# Altium project PCB_Project.PrjPcb
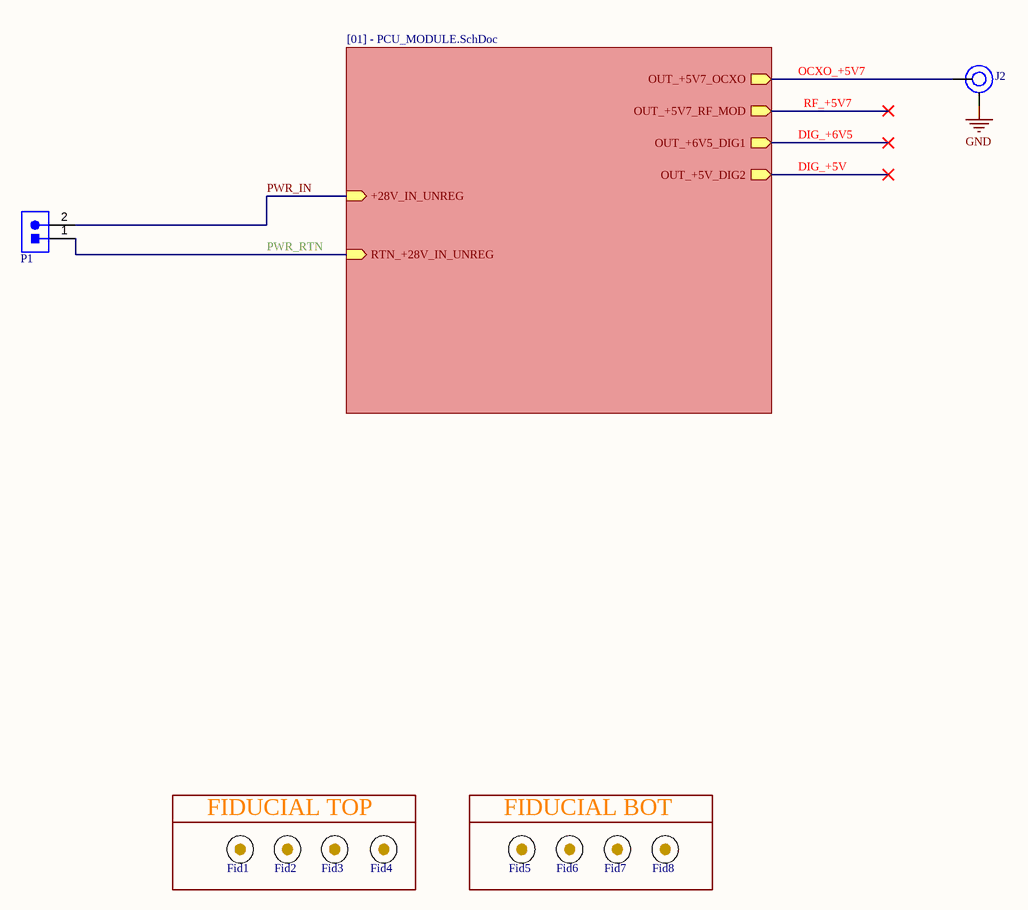
[diagram p0: [00] - INTERFACES_BOARD.SchDoc]
Author: Simone Roticiani; Date: 24/03/2025; MOD. COD.: 000-000-SP-000 rev1; PRJ_Description: DC_0000-B; PRJ_Part_Number: DC_0000; PRJ_SCH_name: DC_0000-SP-rev1
5 sheets, 59 parts. Net scope: hierarchical (ports join the sheet entries above them; power ports are global).
Board files: PCB_Project_1.PcbDoc, PCB_Project_2.PcbDoc
Sheets:
  [00] - INTERFACES_BOARD.SchDoc
     = [01] - PCU_MODULE.SchDoc
      SE05 = [02] - DCDC_+5V7.SchDoc
      SE12 = [04] - PSU_+5V_AUX.SchDoc
      SE10 = [03] - OUT_+5V7_OCXO_PROTECTION.SchDoc

## Sheet [00] - INTERFACES_BOARD.SchDoc
size 420 x 297 mm; CompanyName: Wave; SheetNumber: 1; SheetTotal: 5; PRJ_SheetSize: A3

### Parts
Fid1  Fiducial_V2  [Fiducial]  (value not drawn)  (no BOM)
Fid2  Fiducial_V2  [Fiducial]  (value not drawn)  (no BOM)
Fid3  Fiducial_V2  [Fiducial]  (value not drawn)  (no BOM)
Fid4  Fiducial_V2  [Fiducial]  (value not drawn)  (no BOM)
Fid5  Fiducial_V2  [Fiducial]  (value not drawn)  (no BOM)
Fid6  Fiducial_V2  [Fiducial]  (value not drawn)  (no BOM)
Fid7  Fiducial_V2  [Fiducial]  (value not drawn)  (no BOM)
Fid8  Fiducial_V2  [Fiducial]  (value not drawn)  (no BOM)
J2  SMPM-PC-P-EG-ST-SM-1  [SAMTEC_SMPM-PC-P-EG-ST-SM-1]  (value not drawn)
P1  61300211121  [61300211121]  (value not drawn)

### Blocks framed on the sheet
FIDUCIAL TOP: Fid1-Fid4
FIDUCIAL BOT: Fid5-Fid8

### Sub-sheets
? = [01] - PCU_MODULE.SchDoc: RTN_+28V_IN_UNREG (in), OUT_+5V7_OCXO (out), OUT_+5V7_RF_MOD (out), OUT_+6V5_DIG1 (out), OUT_+5V_DIG2 (out), +28V_IN_UNREG (in)

### Nets
GND: J2.2
DIG_+5V: sheet /OUT_+5V_DIG2
DIG_+6V5: sheet /OUT_+6V5_DIG1
OCXO_+5V7: J2.1 ; sheet /OUT_+5V7_OCXO
PWR_IN: P1.2 ; sheet /+28V_IN_UNREG  [project net OUT_DCDC_+12V]
PWR_RTN: P1.1 ; sheet /RTN_+28V_IN_UNREG
RF_+5V7: sheet /OUT_+5V7_RF_MOD

### Notes on the sheet
- Part Number:
- Description:
- Document:
- Date:
- Size:
- Sheet Title:
- Sheet
- of
- Author:
- MOD. COD.:

### Library data of the parts
Fid1-Fid8 = Fiducial_V2: Fiducial No Pin; Category: Miscellaneous
J2 = SMPM-PC-P-EG-ST-SM-1: Connector SMPM Plug Catchers Mitt 0Hz to 65GHz 50Ohm Solder Straight Surface Mount Gold; Manufacturer: Samtec; Supplier 1: mouser; Manufacturer Part Number: SMPM-PC-P-EG-ST-SM-1; RoHS: No; Category: Connectors; Stock 1: 329; Pricing 1: 1=15,71, 10=14,83, 25=14,31, 50=13,96, 100=12,66, 250=12,22, 500=11,7625 (USD); ComponentLink1URL: https://datasheet.octopart.com/SMPM-PF-P-EG-ST-SM-1-Samtec-datasheet-158267789.pdf?src-supplier=Sager+Electronics; ComponentLink1Description: https://datasheet.octopart.com/SMPM-PF-P-EG-ST-SM-1-Samtec-datasheet-158267789.pdf?src-supplier=Sager+Electronics; Supplier Part Number 1: 200-SMPM-PC-PEGSTSM1
P1 = 61300211121: THT Vertical Pin Header WR-PHD, Pitch 2.54 mm, Single Row, 2 pins; Manufacturer: Wurth Electronics; Current Rating: 3A; Voltage Rating: 250V; Number of Positions: 2; Gender: Male; Connector Type: Male Pin; Pitch: 0.1inch; Supplier 1: RSComponents; Manufacturer Part Number: 61300211121; RoHS: Yes; Category: Headers and Wire Housings; Stock 1: 1855; Pricing 1: 5=0,14100, 50=0,09700, 100=0,07800, 200=0,07300, 500=0,06800 (USD); Mount: Through Hole; Contact Plating: Gold; Housing Material: PBT; Contact Material: Copper Alloy,Copper; Color: Black; Min Operating Temperature: -40°C; Max Operating Temperature: 125°C; Number of Rows: 1; Contact Gender: Male; Packaging: Bulk; Termination: Through Hole; Number of Contacts: 2; Contact Mating Length: 0.236inch; REACH SVHC: Unknown; Lead Free: Lead Free; ComponentLink1URL: https://datasheet.ciiva.com/13619/6130xx11121-48870-13619345.pdf?src-supplier=Mouser; ComponentLink1Description: https://datasheet.ciiva.com/13619/6130xx11121-48870-13619345.pdf?src-supplier=Mouser; Supplier Part Number 1: 8281581

## Sheet [01] - PCU_MODULE.SchDoc
size 297 x 209 mm; CompanyName: Wave; SheetNumber: 2; SheetTotal: 5; PRJ_SheetSize: A4
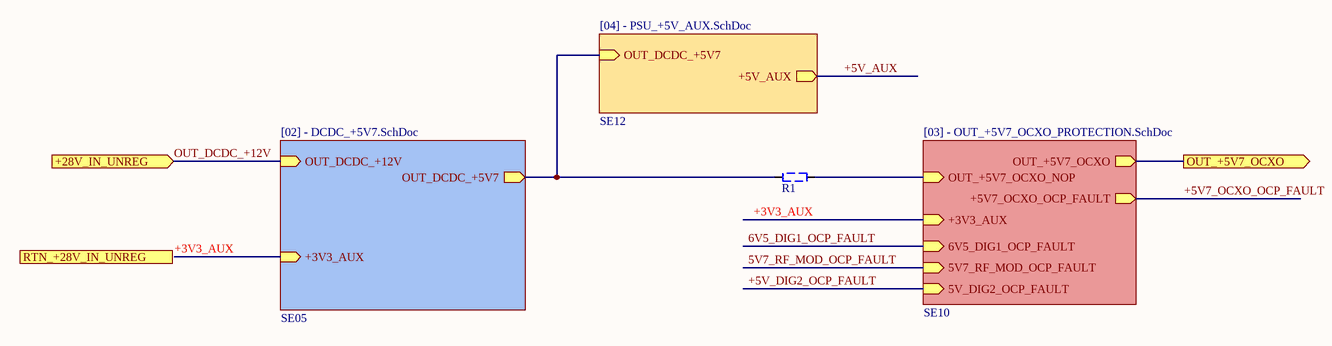
[diagram p1: [01] - PCU_MODULE.SchDoc]

### Parts
R1  NoBom  [RESC1608X50N]  (value not drawn)  (no BOM)

### Sub-sheets
SE05 = [02] - DCDC_+5V7.SchDoc: OUT_DCDC_+12V (in), +3V3_AUX (in), OUT_DCDC_+5V7 (out)
SE10 = [03] - OUT_+5V7_OCXO_PROTECTION.SchDoc: OUT_+5V7_OCXO_NOP (in), +3V3_AUX (in), OUT_+5V7_OCXO (out), +5V7_OCXO_OCP_FAULT (out), 6V5_DIG1_OCP_FAULT (in), 5V7_RF_MOD_OCP_FAULT (in), 5V_DIG2_OCP_FAULT (in)
SE12 = [04] - PSU_+5V_AUX.SchDoc: OUT_DCDC_+5V7 (in), +5V_AUX (out)

### Ports
+28V_IN_UNREG (in, see [00] - INTERFACES_BOARD[4C]), OUT_+5V7_OCXO (out, see [00] - INTERFACES_BOARD[5B], [03] - OUT_+5V7_OCXO_PROTECTION[4A]), RTN_+28V_IN_UNREG (see [00] - INTERFACES_BOARD[4C])

### Nets
+3V3_AUX: sheet SE05/+3V3_AUX, sheet SE10/+3V3_AUX
OCXO_+5V7: port OUT_+5V7_OCXO, sheet SE10/OUT_+5V7_OCXO
OUT_DCDC_+12V: port +28V_IN_UNREG, sheet SE05/OUT_DCDC_+12V
NetC3_2: R1.1 ; sheet SE05/OUT_DCDC_+5V7, sheet SE12/OUT_DCDC_+5V7
NetQ1_5: R1.2 ; sheet SE10/OUT_+5V7_OCXO_NOP

### Notes on the sheet
- Part Number:
- Description:
- Document:
- Date:
- Size:
- Sheet Title:
- Sheet
- of
- Author:
- MOD. COD.:

### Library data of the parts
R1 = 1RES_NO_BOM: Resistore Non in BOM; Category: Resistors

## Sheet [02] - DCDC_+5V7.SchDoc
size 297 x 209 mm; CompanyName: Wave; SheetNumber: 4; SheetTotal: 5; PRJ_SheetSize: A4
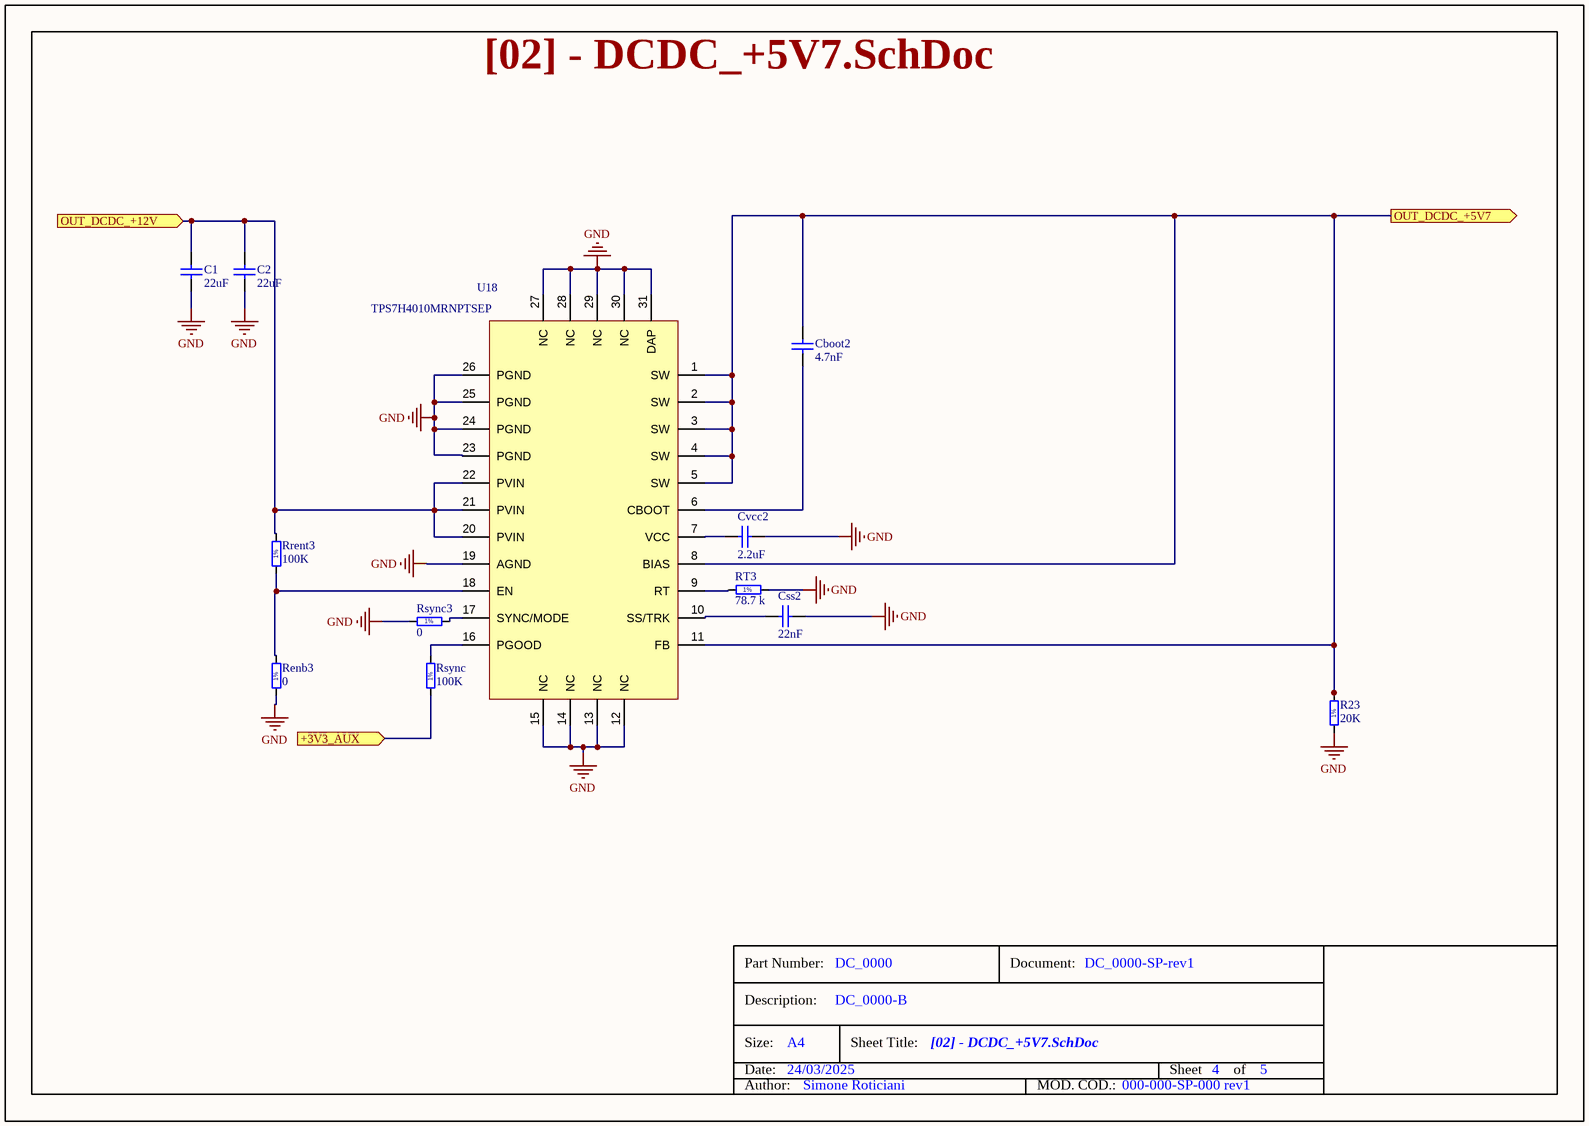
[diagram p2: [02] - DCDC_+5V7.SchDoc]

### Parts
C1  22uF  [CAPC320X160X180L55N]
C2  22uF  [CAPC320X160X180L55N]
Cboot2  4.7nF  [CAPC100X55X55L35N]
Css2  22nF  [CAPC100X55X55L35N]
Cvcc2  2.2uF  [CAPC100X55X55L35N]
R23  20K  [RESC100X50X40L25N]
Renb3  0  [RESC100X50X40L25N]
Rrent3  100K  [RESC100X50X40L25N]
Rsync  100K  [RESC100X50X40L25N]
Rsync3  0  [RESC100X50X40L25N]
RT3  78.7 k  [RESC100X50X40L25N]
U18  TPS7H4010MRNPTSEP  [TPS7H4010MRNPTSEP]

### Ports
+3V3_AUX (in, see [01] - PCU_MODULE[2B], [03] - OUT_+5V7_OCXO_PROTECTION[1C]), OUT_DCDC_+5V7 (out, see [01] - PCU_MODULE[2A], [04] - PSU_+5V_AUX[1A]), OUT_DCDC_+12V (in, see [01] - PCU_MODULE[2A])

### Nets
GND: C1.1 C2.1 Css2.2 Cvcc2.2 R23.1 Renb3.1 Rsync3.1 RT3.2 U18.12(NC) U18.13(NC) U18.14(NC) U18.15(NC) U18.19(AGND) U18.23(PGND) U18.24(PGND) U18.25(PGND) U18.26(PGND) U18.27(NC) U18.28(NC) U18.29(NC) U18.30(NC) U18.31(DAP)
+3V3_AUX: Rsync.1 ; port +3V3_AUX
OUT_DCDC_+12V: C1.2 C2.2 Rrent3.2 U18.20(PVIN) U18.21(PVIN) U18.22(PVIN) ; port OUT_DCDC_+12V
NetC3_2: Cboot2.2 R23.2 U18.1(SW) U18.2(SW) U18.3(SW) U18.4(SW) U18.5(SW) U18.8(BIAS) U18.11(FB) ; port OUT_DCDC_+5V7
NetCboot2_1: Cboot2.1 U18.6(CBOOT)
NetCss2_1: Css2.1 U18.10(SS/TRK)
NetCvcc2_1: Cvcc2.1 U18.7(VCC)
NetRenb3_2: Renb3.2 Rrent3.1 U18.18(EN)
NetRsync3_2: Rsync3.2 U18.17(SYNC/MODE)
NetRsync_2: Rsync.2 U18.16(PGOOD)
NetRT3_1: RT3.1 U18.9(RT)

### Notes on the sheet
- Part Number:
- Description:
- Document:
- Date:
- Size:
- Sheet Title:
- Sheet
- of
- Author:
- MOD. COD.:
- (in symbol CRCW040220K0FKED) 1%
- (in symbol CRCW040278K7FKED) 1%
- (in symbol CRCW0402100KFKED) 1%

### Library data of the parts
C1 C2 = GRM31CC71E226ME15L: CAP CER 22uF 25V ±20% X7S 1206; Manufacturer: Murata; Material: 4241ConductorMaterial; Dielectric: 1542DielectricType; ComponentLink1URL: https://search.murata.co.jp/Ceramy/image/img/A01X/G101/ENG/GRM31CC71E226ME15-01A.pdf; ComponentLink1Description: Datasheet; Supplier: Digikey; Manufacturer Part Number: GRM31CC71E226ME15L; RoHS: No; Category: Ceramic Capacitors; Stock 1: 3447; Pricing 1: 1=0,92, 10=0,562, 50=0,4202, 100=0,3759, 500=0,30056, 1000=0,27702 (USD); Case/Package: 340Case; Min Operating Temperature: -55°C; Max Operating Temperature: 125°C; Capacitance: 22uF; Tolerance: 20%; Voltage Rating: 25V; Voltage Rating (DC): 25V; Length: 3.2mm; Width: 1.6mm; Height: 1.9mm; Thickness: 1.6mm; Supplier Part Number: 490-GRM31CC71E226ME15LCT-ND
Cboot2 = GRM155R71E472KA01: 0402 4.7 nF 25 V ±10% Tolerance X7R SMT Multilayer Ceramic Capacitor; Manufacturer: Murata; Manufacturer Part Number: GRM155R71E472KA01D; Supplier: Farnell; Supplier Part Number: 4326802; RoHS: Yes; Category: Ceramic Capacitors; Stock: 39799; Pricing: 10=0,015, 100=0,01, 500=0,007, 2500=0,006, 5000=0,0059 (EUR); Pins: 2NUMBER; Material: 4241ConductorMaterial; Lead Free: 5697LeadFree; ComponentLink1URL: https://datasheet.ciiva.com/18184/getdatasheetpartid-129543-18184709.pdf?src-supplier=Verical; ComponentLink1Description: https://datasheet.ciiva.com/18184/getdatasheetpartid-129543-18184709.pdf?src-supplier=Verical; ComponentLink2URL: https://datasheet.ciiva.com/130/product-130032.pdf?src-supplier=Digikey; ComponentLink2Description: https://datasheet.ciiva.com/130/product-130032.pdf?src-supplier=Digikey; ComponentLink3URL: https://datasheet.ciiva.com/16392/product-16392847.pdf?src-supplier=Future+Electronics; ComponentLink3Description: https://datasheet.ciiva.com/16392/product-16392847.pdf?src-supplier=Future+Electronics; ComponentLink4URL: https://datasheet.ciiva.com/2989/product-2989394.pdf?src-supplier=Avnet; ComponentLink4Description: https://datasheet.ciiva.com/2989/product-2989394.pdf?src-supplier=Avnet; ComponentLink5URL: https://datasheet.ciiva.com/2989/product-2989393.pdf?src-supplier=Avnet; ComponentLink5Description: https://datasheet.ciiva.com/2989/product-2989393.pdf?src-supplier=Avnet; ComponentLink6URL: https://datasheet.ciiva.com/130/partnumbering-e-01-130033.pdf?src-supplier=Digikey; ComponentLink6Description: https://datasheet.ciiva.com/130/partnumbering-e-01-130033.pdf?src-supplier=Digikey; ComponentLink7URL: https://datasheet.ciiva.com/130/partnumbering-e-01-130034.pdf?src-supplier=Digikey; ComponentLink7Description: https://datasheet.ciiva.com/130/partnumbering-e-01-130034.pdf?src-supplier=Digikey
Css2 = GRM155R71E223JA61: Multilayer Ceramic Capacitor, 0.022 uF, 25 V, ± 5%, X7R, 0402 [1005 Metric]; Manufacturer: Murata; Manufacturer Part Number: GRM155R71E223JA61D; Supplier: Farnell; Supplier Part Number: 3582812; RoHS: Yes; Category: Ceramic Capacitors; Stock: 11149; Pricing: 10=0,017, 100=0,013, 500=0,012, 2500=0,0118, 5000=0,0115 (EUR); Material: 4241ConductorMaterial; ComponentLink1URL: https://datasheet.ciiva.com/5427/product-5427580.pdf?src-supplier=Mouser; ComponentLink1Description: https://datasheet.ciiva.com/5427/product-5427580.pdf?src-supplier=Mouser; ComponentLink2URL: https://datasheet.ciiva.com/29535/grm155r71e223ka61-01-29535418.pdf?src-supplier=Digikey; ComponentLink2Description: https://datasheet.ciiva.com/29535/grm155r71e223ka61-01-29535418.pdf?src-supplier=Digikey
Cvcc2 = GRM155D71C225ME11: Multilayer Ceramic Capacitor, 2.2 uF, 16 V, ± 20%, X7T, 0402 [1005 Metric]; Manufacturer: Murata; Manufacturer Part Number: GRM155D71C225ME11D; Dielectric: 1545DielectricType; Voltage Rating: 16V; Supplier: Mouser; Supplier Part Number: 81-GRM155D71C225ME11; RoHS: Yes; Category: Ceramic Capacitors; Stock: 102807; Pricing: 1=0,17, 10=0,113, 50=0,113, 100=0,073, 1000=0,067, 10000=0,057 (USD); Case/Package: 343Case; Material: 4241ConductorMaterial; Min Operating Temperature: -55°C; Max Operating Temperature: 125°C; Value: 2.2uF; Tolerance: 20%; Voltage Rating (DC): 16V; Length: 1mm; Width: 500um; Height: 650um; Thickness: 500um; RoHS Compliant: Yes; ComponentLink1URL: https://datasheet.octopart.com/GRM155D71C225ME11D-Murata-datasheet-165579666.pdf?src-supplier=TME; ComponentLink1Description: https://datasheet.octopart.com/GRM155D71C225ME11D-Murata-datasheet-165579666.pdf?src-supplier=TME
R23 = CRCW040220K0FKED: RES 20K OHM 1/16W 1% 0402; Manufacturer: Vishay Dale; Power (Watts): 0,063 W, 1/16 W; Temperature Coefficient: ±100 ppm/ °C; Category: Resistors; Resistance: 20K; Tolerance: ±1%; Footprint Name: RESC1005X40N; ComponentLink1URL: http://www.vishay.com/docs/20035/dcrcwe3.pdf; ComponentLink1Description: Datasheet; Packaging: Cut Tape (CT); Supplier Part Number 1: 541-20.0KLCT-ND; Supplier 1: Digi-Key; Features: AEC Q100 automotive; Operating Temperature: -55 °C ~ 155 °C; Package / Case: 0402 (1005 metrico); Manufacturer Part Number: CRCW040220K0FKED; Part Status: Active; Composition: Thick Film; Manufacturer 1: Vishay Dale; Manufacturer Part Number 1: CRCW040220K0FKED
Renb3 Rsync Rsync3 = CRCW0402100KFKED: RES  100K OHM 1/16W 1% 0402; Manufacturer: Vishay Dale; Power (Watts): 0,063 W, 1/16 W; Temperature Coefficient: ±100 ppm/ °C; Category: Resistors; Resistance: 100K; Tolerance: ±1%; Footprint Name: RESC1005X40N; ComponentLink1URL: http://www.vishay.com/docs/20035/dcrcwe3.pdf; ComponentLink1Description: Datasheet; Packaging: Cut Tape (CT); Supplier Part Number 1: 541-100KLCT-ND; Supplier 1: Digi-Key; Features: AEC Q100 automotive; Operating Temperature: -55 °C ~ 155 °C; Package / Case: 0402 (1005 metrico); Manufacturer Part Number: CRCW0402100KFKED; Part Status: Active; Composition: Thick Film; Manufacturer 1: Vishay Dale; Manufacturer Part Number 1: CRCW0402100KFKED
Rrent3 = CRCW0402100KFKED: RES 100K OHM 1/16W 1% 0402; Manufacturer: Vishay Dale; Power (Watts): 0,063 W, 1/16 W; Temperature Coefficient: ±100 ppm/ °C; Category: Resistors; Resistance: 100K; Tolerance: ±1%; Footprint Name: RESC1005X40N; ComponentLink1URL: http://www.vishay.com/docs/20035/dcrcwe3.pdf; ComponentLink1Description: Datasheet; Packaging: Cut Tape (CT); Supplier Part Number 1: 541-100KLCT-ND; Supplier 1: Digi-Key; Features: AEC Q100 automotive; Operating Temperature: -55 °C ~ 155 °C; Package / Case: 0402 (1005 metrico); Manufacturer Part Number: CRCW0402100KFKED; Part Status: Active; Composition: Thick Film; Manufacturer 1: Vishay Dale; Manufacturer Part Number 1: CRCW0402100KFKED
RT3 = CRCW040278K7FKED: RES 78K7 OHM 1/16W 1% 0402; Manufacturer: Vishay Dale; Power (Watts): 0,063 W, 1/16 W; Temperature Coefficient: ±100 ppm/ °C; Category: Resistors; Resistance: 78K7; Tolerance: ±1%; Footprint Name: RESC1005X40N; ComponentLink1URL: http://www.vishay.com/docs/20035/dcrcwe3.pdf; ComponentLink1Description: Datasheet; Packaging: Cut Tape (CT); Supplier Part Number 1: 541-78.7KLCT-ND; Supplier 1: DigiKey; Features: AEC Q100 automotive; Operating Temperature: -55 °C ~ 155 °C; Package / Case: 0402 (1005 metrico); Manufacturer Part Number: CRCW040278K7FKED; Part Status: Active; Composition: Thick Film; Manufacturer 1: Vishay Dale; Manufacturer Part Number 1: CRCW040278K7FKED
U18 = TPS7H4010MRNPTSEP: Buck Switching Regulator IC Positive Adjustable 1V 1 Output 6A 30-WFQFN Exposed Pad; Manufacturer: Texas Instruments; Supplier: Digikey; Manufacturer Part Number: TPS7H4010MRNPTSEP; RoHS: Yes; Category: Integrated Circuits (ICs); Supplier Part Number: 296-TPS7H4010MRNPTSEP-ND; ComponentLink1Description: Datasheet; ComponentLink1URL: https://www.ti.com/lit/ds/symlink/tps7h4010-sep.pdf?ts=1730267059055&ref_url=https%253A%252F%252Fwww.mouser.ca%252F

## Sheet [04] - PSU_+5V_AUX.SchDoc
size 297 x 209 mm; CompanyName: Wave; SheetNumber: 5; SheetTotal: 5; PRJ_SheetSize: A4
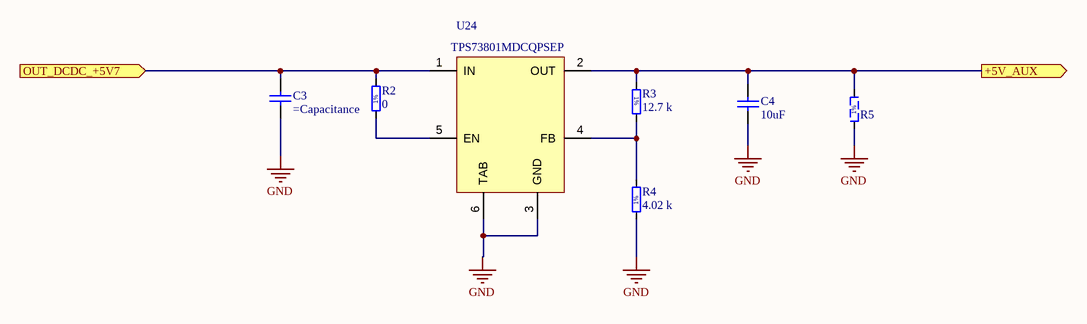
[diagram p3: [04] - PSU_+5V_AUX.SchDoc]

### Parts
C3  (no value)  [CAPC100X55X55L35N]
C4  10uF  [CAPC320X160X180L55N]
R2  0  [RESC100X50X40L25N]
R3  12.7 k  [RESC100X50X40L25N]
R4  4.02 k  [RESC100X50X40L25N]
R5  NoBom  [RESC2012X60N]  (value not drawn)  (no BOM)
U24  TPS73801MDCQPSEP  [SOT127P706X180-6N]

### Ports
+5V_AUX (out, see [01] - PCU_MODULE[3A]), OUT_DCDC_+5V7 (in, see [01] - PCU_MODULE[3A], [02] - DCDC_+5V7[4A])

### Nets
GND: C3.1 C4.1 R4.1 R5.1 U24.3(GND) U24.6(TAB)
+5V_AUX: C4.2 R3.1 R5.2 U24.2(OUT) ; port +5V_AUX
NetC3_2: C3.2 R2.2 U24.1(IN) ; port OUT_DCDC_+5V7
NetR2_1: R2.1 U24.5(EN)
NetR3_2: R3.2 R4.2 U24.4(FB)

### Notes on the sheet
- Part Number:
- Description:
- Document:
- Date:
- Size:
- Sheet Title:
- Sheet
- of
- Author:
- MOD. COD.:
- (in symbol 1RES_NO_BOM_0805) 1%
- (in symbol CRCW04024K02FKED) 1%
- (in symbol CRCW040212K7FKED) 1%
- (in symbol CRCW04020000Z0EDC) 1%

### Library data of the parts
C3 = GRM155R71E223JA61: Multilayer Ceramic Capacitor, 0.022 uF, 25 V, ± 5%, X7R, 0402 [1005 Metric]; Manufacturer: Murata; Manufacturer Part Number: GRM155R71E223JA61D; Material: 4241ConductorMaterial; Supplier: Farnell; Supplier Part Number: 3582812; RoHS: Yes; Category: Ceramic Capacitors; Stock: 11149; Pricing: 10=0,017, 100=0,013, 500=0,012, 2500=0,0118, 5000=0,0115 (EUR); ComponentLink1URL: https://datasheet.ciiva.com/5427/product-5427580.pdf?src-supplier=Mouser; ComponentLink1Description: https://datasheet.ciiva.com/5427/product-5427580.pdf?src-supplier=Mouser; ComponentLink2URL: https://datasheet.ciiva.com/29535/grm155r71e223ka61-01-29535418.pdf?src-supplier=Digikey; ComponentLink2Description: https://datasheet.ciiva.com/29535/grm155r71e223ka61-01-29535418.pdf?src-supplier=Digikey
C4 = C3216X7R1H106K160AC: CAP CER 10UF 50V X7R 1206; Manufacturer: TDK; Material: 4241ConductorMaterial; Tolerance: 10%; Dielectric: 1511DielectricType; Supplier 1: Avnet; Manufacturer Part Number: C3216X7R1H106K160AC; RoHS: Yes; Category: Ceramic Capacitors; Stock 1: 19909; Pricing 1: 1=0,797, 10=0,603, 25=0,57, 50=0,537, 100=0,505 (USD); Mount: Surface Mount; Case/Package: 1206; Case Code (Imperial): 1206; Case Code (Metric): 3216; Min Operating Temperature: -55°C; Max Operating Temperature: 125°C; Series: C; Packaging: Cut Tape; Capacitance: 10uF; Voltage Rating: 50V; Voltage Rating (DC): 50V; Length: 3.2mm; Width: 1.6mm; Height: 1.9mm; Thickness: 1.6mm; RoHS Compliant: Yes; Lead Free: 5697LeadFree; ComponentLink1URL: https://product.tdk.com/info/en/catalog/datasheets/mlcc_commercial_general_en.pdf?src-supplier=Digikey; ComponentLink1Description: https://product.tdk.com/info/en/catalog/datasheets/mlcc_commercial_general_en.pdf?src-supplier=Digikey; ComponentLink2URL: https://datasheet.octopart.com/C3216X7R1H106K160AC-TDK-datasheet-159617022.pdf?src-supplier=TME; ComponentLink2Description: https://datasheet.octopart.com/C3216X7R1H106K160AC-TDK-datasheet-159617022.pdf?src-supplier=TME; Supplier Part Number 1: 71AH3370
R2 = CRCW04020000Z0EDC: RES 0 OHM 1/16W 1% 0402; Manufacturer: Vishay; Temperature Coefficient: ±100 ppm/ °C; Power (Watts): 0,063 W, 1/16 W; Supplier 1: Digi-Key; Manufacturer Part Number: CRCW04020000Z0EDC; Resistance: 0; Tolerance: ±1%; ComponentLink1URL: http://www.vishay.com/docs/28773/crcwce3.pdf?src-supplier=Digi-Key; ComponentLink1Description: http://www.vishay.com/docs/28773/crcwce3.pdf?src-supplier=Digi-Key; Supplier Part Number 1: 541-4062-1-ND; Manufacturer 1: Vishay; Manufacturer Part Number 1: CRCW04020000Z0EDC; Category: Resistors; Composition: Thick Film; Features: AEC Q100 automotive; Footprint Name: RESC100X50X40L25N; Operating Temperature: -55 °C ~ 155 °C; Package / Case: 0402 (1005 metrico); Packaging: Cut Tape (CT); Part Status: Active; Description 1: RES 0 OHM 1/16W 1% 0402
R3 = CRCW040212K7FKED: RES 12K7 OHM 1/16W 1% 0402; Manufacturer: Vishay Dale; Power (Watts): 0,063 W, 1/16 W; Temperature Coefficient: ±100 ppm/ °C; Category: Resistors; Resistance: 12K7; Tolerance: ±1%; Footprint Name: RESC1005X40N; ComponentLink1URL: http://www.vishay.com/docs/20035/dcrcwe3.pdf; ComponentLink1Description: Datasheet; Packaging: Cut Tape (CT); Supplier Part Number 1: 541-12.7KLCT-ND; Supplier 1: Digi-Key; Features: AEC Q100 automotive; Operating Temperature: -55 °C ~ 155 °C; Package / Case: 0402 (1005 metrico); Manufacturer Part Number: CRCW040212K7FKED; Part Status: Active; Composition: Thick Film; Manufacturer 1: Vishay Dale; Manufacturer Part Number 1: CRCW040212K7FKED
R4 = CRCW04024K02FKED: RES 4K02 OHM 1/16W 1% 0402; Manufacturer: Vishay Dale; Power (Watts): 0,063 W, 1/16 W; Temperature Coefficient: ±100 ppm/ °C; Category: Resistors; Resistance: 4K02; Tolerance: ±1%; Footprint Name: RESC1005X40N; ComponentLink1URL: http://www.vishay.com/docs/20035/dcrcwe3.pdf; ComponentLink1Description: Datasheet; Packaging: Cut Tape (CT); Supplier Part Number 1: 541-4.02KLCT-ND; Supplier 1: DigiKey; Features: AEC Q100 automotive; Operating Temperature: -55 °C ~ 155 °C; Package / Case: 0402 (1005 metrico); Manufacturer Part Number: CRCW04024K02FKED; Part Status: Active; Composition: Thick Film; Manufacturer 1: Vishay Dale; Manufacturer Part Number 1: CRCW04024K02FKED
R5 = 1RES_NO_BOM_0805: Resistore Non in BOM; Category: Resistors
U24 = TPS73801MDCQPSEP: LDO Voltage Regulators Radiation-tolerant, 2.2-V to 20-V input, 1-A adjustable LDO regulator in a plastic package 6-SOT-223 -55 to 125; Manufacturer: Texas Instruments; Voltage - Output: 1.21V ~ -20 V; Current - Output: 1A; Voltage - Input: 1.4V ~ -20 V; Number of Regulators: 1; Regulator Type: Positive Adjustable; Supplier: Mouser; Supplier Part Number: 595-TPS73801MDCQPSEP; Manufacturer Part Number: TPS73801MDCQPSEP; RoHS: RoHS Compliant; Category: Regulators; Packaging: Cut Tape (CT); Part Status: Active; Operating Temperature: -55°C ~ 125°C; Mounting Type: Surface Mount; Package / Case: SOT-223 (6); ComponentLink1URL: https://www.ti.com/lit/ds/symlink/tps73801-sep.pdf?ts=1731944378746&ref_url=https%253A%252F%252Fwww.ti.com%252Fproduct%252FTPS73801-SEP; ComponentLink1Description: Datasheet

## Sheet [03] - OUT_+5V7_OCXO_PROTECTION.SchDoc
size 297 x 209 mm; CompanyName: Wave; SheetNumber: 3; SheetTotal: 5; PRJ_SheetSize: A4
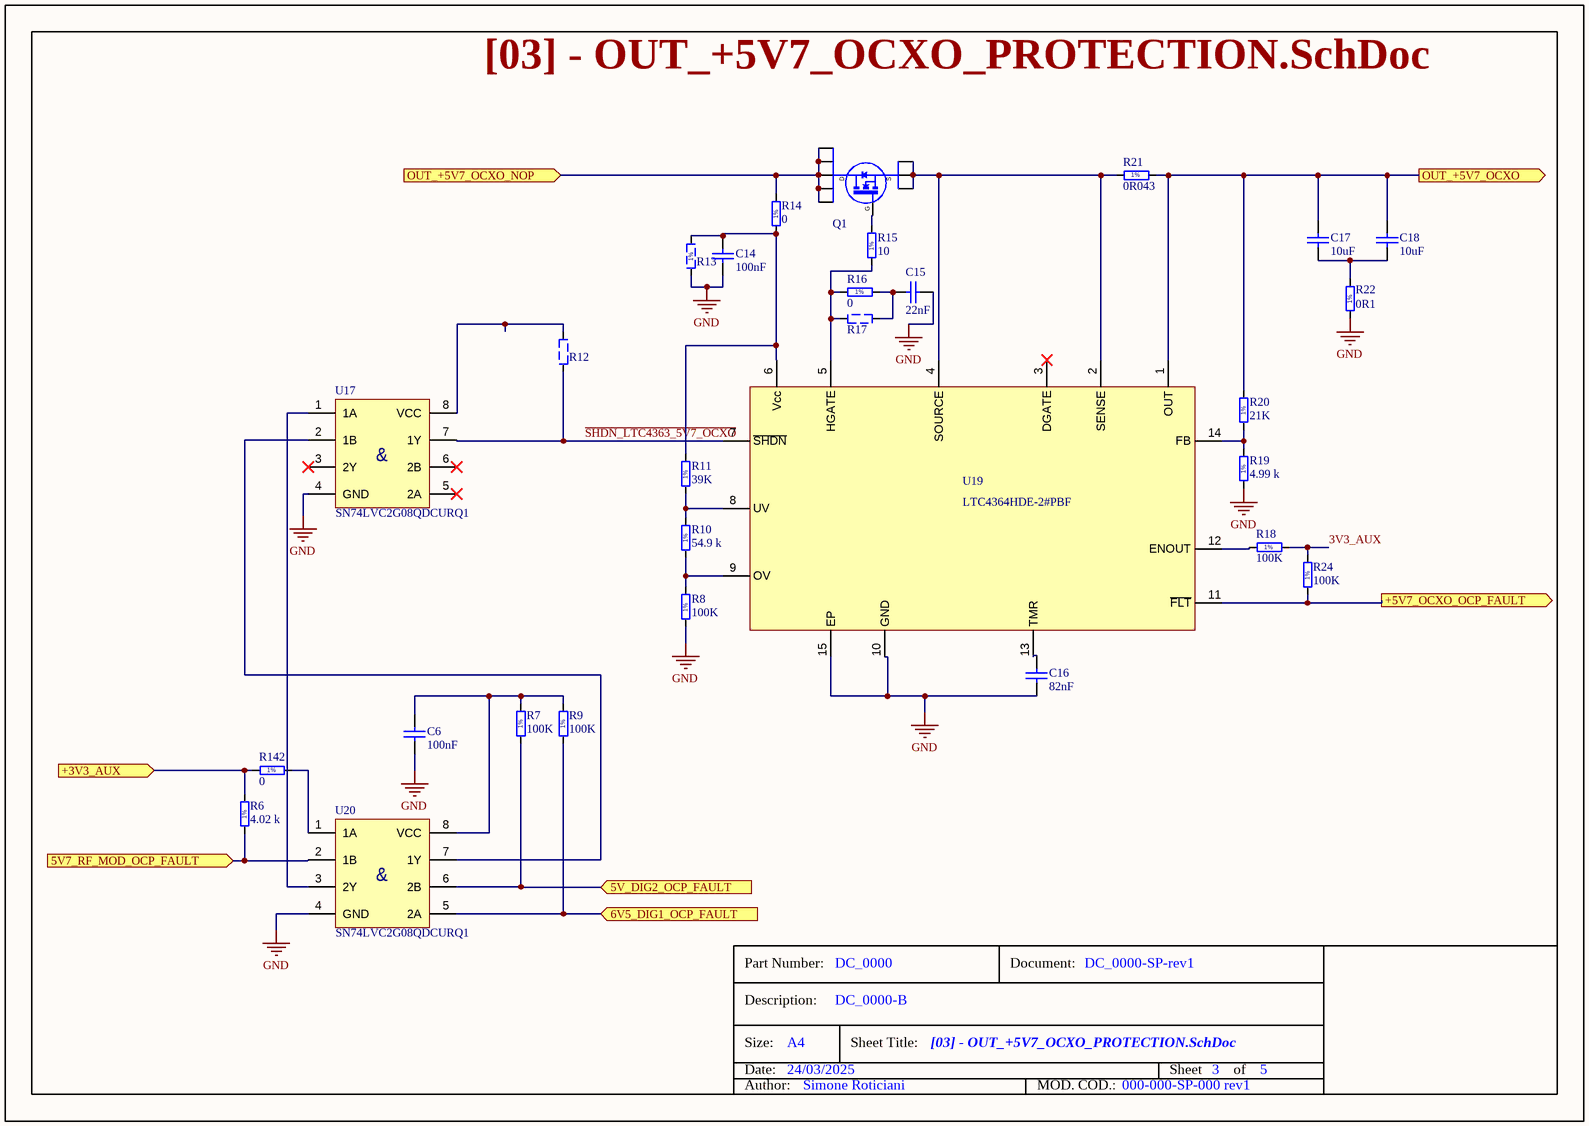
[diagram p4: [03] - OUT_+5V7_OCXO_PROTECTION.SchDoc]

### Parts
C6  100nF  [CAPC100X50X55L25N]
C14  100nF  [CAPC100X50X55L25N]
C15  22nF  [CAPC160X80X90L35N]
C16  82nF  [CAPC160X80X90L35N]
C17  10uF  [CAPC320X160X180L55N]
C18  10uF  [CAPC320X160X180L55N]
Q1  SI7414DN-T1-GE3  [Vishay PowerPAK 1212-8 package]  (value not drawn)
R6  4.02 k  [RESC100X50X40L25N]
R7  100K  [RESC100X50X40L25N]
R8  100K  [RESC100X50X40L25N]
R9  100K  [RESC100X50X40L25N]
R10  54.9 k  [RESC100X50X40L25N]
R11  39K  [RESC100X50X40L25N]
R12  NoBom  [RESC1608X50N]  (value not drawn)  (no BOM)
R13  NoBom  [RESC155X85X55L30N - NO BOM]  (value not drawn)  (no BOM)
R14  0  [RESC155X85X55L30N]
R15  10  [RESC100X50X40L25N]
R16  0  [RESC100X50X40L25N]
R17  NoBom  [RESC1608X50N]  (value not drawn)  (no BOM)
R18  100K  [RESC100X50X40L25N]
R19  4.99 k  [RESC100X50X40L25N]
R20  21K  [RESC100X50X40L25N]
R21  0R043  [RESC315X160X65L50N]
R22  0R1  [RESC100X50X40L25N]
R24  100K  [RESC100X50X40L25N]
R142  0  [RESC100X50X40L25N]
U17  SN74LVC2G08QDCURQ1  [SOP50P310X90-8N]
U19  LTC4364HDE-2#PBF  [DFN15P50_300X400X80L40X30T175X335]
U20  SN74LVC2G08QDCURQ1  [SOP50P310X90-8N]

### Ports
5V7_RF_MOD_OCP_FAULT (in, see [01] - PCU_MODULE[3B]), 5V_DIG2_OCP_FAULT (in, see [01] - PCU_MODULE[3B]), 6V5_DIG1_OCP_FAULT (in, see [01] - PCU_MODULE[3B]), +3V3_AUX (in, see [01] - PCU_MODULE[3B], [02] - DCDC_+5V7[1C]), +5V7_OCXO_OCP_FAULT (out, see [01] - PCU_MODULE[4B]), OUT_+5V7_OCXO (out, see [01] - PCU_MODULE[4A]), OUT_+5V7_OCXO_NOP (in, see [01] - PCU_MODULE[3A])

### Nets
GND: C6.1 C14.1 C15.2 C16.1 R8.1 R13.1 R19.1 R22.1 U17.4(GND) U19.10(GND) U19.15(EP) U20.4(GND)
3V3_AUX: R18.2 R24.2
5V7_RF_MOD_OCP_FAULT: R6.1 U20.2(1B) ; port 5V7_RF_MOD_OCP_FAULT
6V5_DIG1_OCP_FAULT: R9.1 U20.5(2A) ; port 6V5_DIG1_OCP_FAULT
+3V3_AUX: R6.2 R142.1 ; port +3V3_AUX
+5V7_OCXO_OCP_FAULT: R24.1 U19.11(~{FLT}) ; port +5V7_OCXO_OCP_FAULT
+5V_DIG2_OCP_FAULT: R7.1 U20.6(2B) ; port 5V_DIG2_OCP_FAULT
OCXO_+5V7: C17.2 C18.2 R20.2 R21.2 U19.1(OUT) ; port OUT_+5V7_OCXO
~{SHDN_LTC4363_5V7_OCXO}: R12.1 U17.7(1Y) U19.7(~{SHDN})
NetC6_2: C6.2 R7.2 R9.2 U20.8(VCC)
NetC14_2: C14.2 R11.2 R13.2 R14.1 U19.6(Vcc)
NetC15_1: C15.1 R16.2 R17.2
NetC16_2: C16.2 U19.13(TMR)
NetC17_1: C17.1 C18.1 R22.2
NetQ1_1: Q1.1(S) Q1.2(S) Q1.3(S) R21.1 U19.2(SENSE) U19.4(SOURCE)
NetQ1_4: Q1.4(G) R15.2
NetQ1_5: Q1.5(D) Q1.6(D) Q1.7(D) Q1.8(D) Q1.9(D) R14.2 ; port OUT_+5V7_OCXO_NOP
NetR8_2: R8.2 R10.1 U19.9(OV)
NetR10_2: R10.2 R11.1 U19.8(UV)
NetR12_2: R12.2 U17.8(VCC)
NetR15_1: R15.1 R16.1 R17.1 U19.5(HGATE)
NetR18_1: R18.1 U19.12(ENOUT)
NetR19_2: R19.2 R20.1 U19.14(FB)
NetR142_2: R142.2 U20.1(1A)
NetU17_1: U17.1(1A) U20.3(2Y)
NetU17_2: U17.2(1B) U20.7(1Y)

Not connected (* = marked no-connect by the designer): U17 3(2Y)* 5(2A)* 6(2B)*; U19 3(DGATE)*

### Notes on the sheet
- Part Number:
- Description:
- Document:
- Date:
- Size:
- Sheet Title:
- Sheet
- of
- Author:
- MOD. COD.:
- (in symbol 1RES_NO_BOM_0603) 1%
- (in symbol CRCW04024K02FKED) 1%
- (in symbol CRCW04024K99FKED) 1%
- (in symbol CRCW040210R0FKED) 1%
- (in symbol CRCW040221K0FKED) 1%
- (in symbol CRCW040239K0FKED) 1%
- (in symbol CRCW040254K9FKED) 1%
- (in symbol CRCW0402100KFKEDC) 1%
- (in symbol CRCW04020000Z0EDC) 1%
- (in symbol RMCF0603ZT0R00) 1%
- (in symbol RUT1005FR100CS) 1%
- (in symbol SN74LVC2G08QDCURQ1) &
- (in symbol WSTM1206QLR043FNR) 1%

### Library data of the parts
C6 = C1005X7R1H104K050BB: CAP CER 100nF 50V ±10% X7R 0402; Manufacturer 1: TDK; Capacitor Type: Ceramic; Supplier 1: Digi-Key; Capacitance: 100nF; Voltage Rating: 50V; Tolerance: ±10%; Packaging: Cut Tape (CT); ComponentLink1URL: http://www.farnell.com/datasheets/1796654.pdf?src-supplier=Newark; ComponentLink1Description: http://www.farnell.com/datasheets/1796654.pdf?src-supplier=Newark; Supplier Part Number 1: 445-5932-1-ND; Manufacturer Part Number 1: C1005X7R1H104K050BB; Applications: General Purpose; Category: Capacitors; Description 1: CAP CER 100nF 50V ±10% X7R 0402; Features: -; Footprint Name: CAPC100X50X55L25N; Mounting Type: Surface Mount; Operating Temperature: -55°C ~ 125°C; Package / Case: 0402 (1005 Metric); Part Status: Active; RoHS: RoHS Compliant; Temperature Coefficient: X7R
C14 = C1005X7R1H104K050BB: CAP CER 100nF 50V ±10% X7R 0402; Manufacturer: TDK; Dielectric Material: Ceramic; Supplier 1: Rs; Manufacturer Part Number: C1005X7R1H104K050BB; RoHS: Yes; Category: Ceramic Capacitors; Stock 1: 9900; Pricing 1: 100=0,04100, 200=0,02500, 500=0,02100, 1000=0,01700 (EUR); Mount: Surface Mount; Case/Package: 0402; Case Code (Imperial): 0402; Case Code (Metric): 1005; Weight: 2.3E-05oz; Min Operating Temperature: -55°C; Max Operating Temperature: 125°C; Capacitance: 100nF; Voltage Rating: 50V; Tolerance: 10%; Packaging: Tape and Reel; Voltage Rating (DC): 50V; Dielectric: X7R; Termination: SMD/SMT; Voltage: 50V; Construction: Flat; Package Quantity: 1; Resistor Type: Ceramic; Series: C; Length: 1mm; Width: 0.02inch; Height: 0.5mm; Depth: 0.5mm; Thickness: 0.022inch; Radiation Hardening: No; Lead Free: Lead Free; RoHS Compliant: Yes; ComponentLink1URL: https://datasheet.ciiva.com/16427/c1005x7r1h104k050bb-16427685.pdf?src-supplier=Future+Electronics; ComponentLink1Description: https://datasheet.ciiva.com/16427/c1005x7r1h104k050bb-16427685.pdf?src-supplier=Future+Electronics; ComponentLink2URL: https://datasheet.ciiva.com/26285/2983c1005x7r1h104k050bb-26285417.pdf?src-supplier=Onlinecomponents.com; ComponentLink2Description: https://datasheet.ciiva.com/26285/2983c1005x7r1h104k050bb-26285417.pdf?src-supplier=Onlinecomponents.com; ComponentLink3URL: https://datasheet.ciiva.com/22725/1913358-22725480.pdf?src-supplier=Element14; ComponentLink3Description: https://datasheet.ciiva.com/22725/1913358-22725480.pdf?src-supplier=Element14; ComponentLink4URL: https://datasheet.ciiva.com/6292/tdkmlcccaprange-6292410.pdf?src-supplier=Digi-Key; ComponentLink4Description: https://datasheet.ciiva.com/6292/tdkmlcccaprange-6292410.pdf?src-supplier=Digi-Key; ComponentLink5URL: https://datasheet.ciiva.com/22725/1913358-22725482.pdf?src-supplier=Element14; ComponentLink5Description: https://datasheet.ciiva.com/22725/1913358-22725482.pdf?src-supplier=Element14; ComponentLink6URL: https://datasheet.ciiva.com/23802/1796654-23802749.pdf?src-supplier=Newark; ComponentLink6Description: https://datasheet.ciiva.com/23802/1796654-23802749.pdf?src-supplier=Newark; ComponentLink7URL: https://datasheet.ciiva.com/48671/e412-c-48671294.pdf?src-supplier=Avnet; ComponentLink7Description: https://datasheet.ciiva.com/48671/e412-c-48671294.pdf?src-supplier=Avnet; ComponentLink8URL: https://datasheet.ciiva.com/6292/tdkmlcccaprange-6292415.pdf?src-supplier=Digi-Key; ComponentLink8Description: https://datasheet.ciiva.com/6292/tdkmlcccaprange-6292415.pdf?src-supplier=Digi-Key; Supplier Part Number 1: 2427315
C15 = 885012206091: CAP CER 22nF 50V ±10% X7R 0603; Manufacturer 1: Wurth Electronics Inc.; Capacitor Type: Ceramic; Capacitance: 22nF; Applications: General Purpose; Supplier Part Number 1: 732-8009-1-ND; Features: -; Footprint Name: CAPC1608X85N; Manufacturer Part Number 1: 885012206091; Mounting Type: Surface Mount; Operating Temperature: -55°C ~ 125°C; Package / Case: 0603 (1608 Metric); Packaging: Cut Tape (CT); Part Status: Active; Temperature Coefficient: X7R; Tolerance: ±10%; Supplier 1: Digi-Key; Category: Capacitors; ComponentLink1URL: https://katalog.we-online.de/pbs/datasheet/885012206091.pdf; ComponentLink1Description: Online Datasheet; Voltage Rating: 50V; RoHS: RoHS Compliant; Description 1: CAP CER 22nF 50V ±10% X7R 0603
C16 = KAM15AR71H823KT: CAP CER 82nF 50V ±10% X7R 0603; Manufacturer: KYOCERA AVX; Capacitor Type: Ceramic; RoHS: RoHS Compliant; Category: Capacitors; Packaging: Cut Tape (CT); Part Status: Active; Capacitance: 82nF; Tolerance: ±10%; Temperature Coefficient: X7R; Operating Temperature: -55°C ~ 125°C; Features: -; Applications: General Purpose; Mounting Type: Surface Mount; Package / Case: 0603 (1608 Metric); ComponentLink1URL: https://datasheets.kyocera-avx.com/AutoMLCCKAM.pdf; ComponentLink1Description: Datasheet; Supplier: Digi-Key; Supplier Part Number: 478-KAM15AR71H823KTCT-ND; Footprint Name: CAPC160X80X90L35N; Manufacturer Part Number: KAM15AR71H823KT; Voltage Rating: 50V
C17 C18 = C3216X7R1H106K160AC: as C4 on sheet [04] - PSU_+5V_AUX; Supplier 1: Avnet; Manufacturer Part Number: C3216X7R1H106K160AC; RoHS: Yes; Category: Ceramic Capacitors; Stock 1: 19909; Pricing 1: 1=0,797, 10=0,603, 25=0,57, 50=0,537, 100=0,505 (USD); Mount: Surface Mount; Case/Package: 1206; Case Code (Imperial): 1206; Case Code (Metric): 3216; Min Operating Temperature: -55°C; Max Operating Temperature: 125°C; Series: C; Packaging: Cut Tape; Capacitance: 10uF; Voltage Rating: 50V; Voltage Rating (DC): 50V; Length: 3.2mm; Width: 1.6mm; Height: 1.9mm; Thickness: 1.6mm; RoHS Compliant: Yes; Lead Free: 5697LeadFree; ComponentLink1URL: https://product.tdk.com/info/en/catalog/datasheets/mlcc_commercial_general_en.pdf?src-supplier=Digikey; ComponentLink1Description: https://product.tdk.com/info/en/catalog/datasheets/mlcc_commercial_general_en.pdf?src-supplier=Digikey; ComponentLink2URL: https://datasheet.octopart.com/C3216X7R1H106K160AC-TDK-datasheet-159617022.pdf?src-supplier=TME; ComponentLink2Description: https://datasheet.octopart.com/C3216X7R1H106K160AC-TDK-datasheet-159617022.pdf?src-supplier=TME; Supplier Part Number 1: 71AH3370
Q1 = SI7414DN-T1-GE3: MOSFET N-CH 60V 5.6A PPAK1212-8; Manufacturer: Vishay Siliconix; Supplier: Digikey; Manufacturer Part Number: SI7414DN-T1-GE3; RoHS: Yes; Category: MOSFETs; Stock 1: 6579; Pricing 1: 1=2,27, 10=1,455, 100=0,9898, 500=0,79058, 1000=0,72652 (USD); Supplier Part Number: SI7414DN-T1-GE3CT-ND; ComponentLink1Description: Datasheet; ComponentLink1URL: https://www.vishay.com/docs/71738/71738.pdf
R6 = CRCW04024K02FKED: as R4 on sheet [04] - PSU_+5V_AUX; Category: Resistors; Resistance: 4K02; Tolerance: ±1%; Footprint Name: RESC1005X40N; ComponentLink1URL: http://www.vishay.com/docs/20035/dcrcwe3.pdf; ComponentLink1Description: Datasheet; Packaging: Cut Tape (CT); Supplier Part Number 1: 541-4.02KLCT-ND; Supplier 1: DigiKey; Features: AEC Q100 automotive; Operating Temperature: -55 °C ~ 155 °C; Package / Case: 0402 (1005 metrico); Manufacturer Part Number: CRCW04024K02FKED; Part Status: Active; Composition: Thick Film; Manufacturer 1: Vishay Dale; Manufacturer Part Number 1: CRCW04024K02FKED
R7-R9 R18 R24 = CRCW0402100KFKEDC: RES 100K OHM 1/16W 1% 0402; Manufacturer: Vishay; Temperature Coefficient: ±100 ppm/ °C; Power (Watts): 0,063 W, 1/16 W; Supplier 1: Digi-Key; Manufacturer Part Number: CRCW0402100KFKEDC; Resistance: 100K; Tolerance: ±1%; Supplier Part Number 1: 541-3960-1-ND; Manufacturer 1: Vishay; Manufacturer Part Number 1: CRCW0402100KFKEDC; Category: Resistors; Composition: Thick Film; Features: AEC Q100 automotive; Footprint Name: RESC100X50X40L25N; Operating Temperature: -55 °C ~ 155 °C; Package / Case: 0402 (1005 metrico); Packaging: Cut Tape (CT); Part Status: Active; ComponentLink1Description: Datasheet; ComponentLink1URL: https://www.vishay.com/docs/28773/crcwce3.pdf; Description 1: RES 100K OHM 1/16W 1% 0402
R10 = CRCW040254K9FKED: RES 54K9 OHM 1/16W 1% 0402; Manufacturer: Vishay Dale; Power (Watts): 0,063 W, 1/16 W; Temperature Coefficient: ±100 ppm/ °C; Category: Resistors; Resistance: 54K9; Tolerance: ±1%; Footprint Name: RESC1005X40N; ComponentLink1URL: http://www.vishay.com/docs/20035/dcrcwe3.pdf; ComponentLink1Description: Datasheet; Packaging: Cut Tape (CT); Supplier Part Number 1: 541-54.9KLCT-ND; Supplier 1: DigiKey; Features: AEC Q100 automotive; Operating Temperature: -55 °C ~ 155 °C; Package / Case: 0402 (1005 metrico); Manufacturer Part Number: CRCW040254K9FKED; Part Status: Active; Composition: Thick Film; Manufacturer 1: Vishay Dale; Manufacturer Part Number 1: CRCW040254K9FKED
R11 = CRCW040239K0FKED: RES 39K OHM 1/16W 1% 0402; Manufacturer: Vishay Dale; Power (Watts): 0,063 W, 1/16 W; Temperature Coefficient: ±100 ppm/ °C; Category: Resistors; Resistance: 39K; Tolerance: ±1%; Footprint Name: RESC1005X40N; ComponentLink1URL: http://www.vishay.com/docs/20035/dcrcwe3.pdf; ComponentLink1Description: Datasheet; Packaging: Cut Tape (CT); Supplier Part Number 1: 541-39.0KLCT-ND; Supplier 1: DigiKey; Features: AEC Q100 automotive; Operating Temperature: -55 °C ~ 155 °C; Package / Case: 0402 (1005 metrico); Manufacturer Part Number: CRCW040239K0FKED; Part Status: Active; Composition: Thick Film; Manufacturer 1: Vishay Dale; Manufacturer Part Number 1: CRCW040239K0FKED
R12 R17 = 1RES_NO_BOM: Resistore Non in BOM; Category: Resistors
R13 = 1RES_NO_BOM_0603: Resistore Non in BOM; Category: Resistors
R14 = RMCF0603ZT0R00: RES 0 OHM 1/10W 1% 0603; Manufacturer: Stackpole Electronics Inc; Temperature Coefficient: ±100 ppm/ °C; Power (Watts): 0,1 W, 1/10 W; Supplier 1: Digi-Key; Manufacturer Part Number: RMCF0603ZT0R00; Resistance: 0; Tolerance: ±1%; Supplier Part Number 1: RMCF0603ZT0R00CT-ND; Manufacturer 1: Stackpole Electronics Inc; Manufacturer Part Number 1: RMCF0603ZT0R00; Category: Resistors; Composition: Thick Film; Features: AEC Q200 automotive; Footprint Name: RESC155X85X55L30N; Operating Temperature: -55 °C ~ 155 °C; Package / Case: 0603 (1608 metrico); Packaging: Cut Tape (CT); Part Status: Active; ComponentLink1Description: Datasheet; ComponentLink1URL: https://www.seielect.com/catalog/sei-rmcf_rmcp.pdf; Description 1: RES 0 OHM 1/10W 1% 0603
R15 = CRCW040210R0FKED: RES 10 OHM 1/16W 1% 0402; Manufacturer: Vishay Dale; Power (Watts): 0,063 W, 1/16 W; Temperature Coefficient: ±100 ppm/ °C; Category: Resistors; Resistance: 10; Tolerance: ±1%; Footprint Name: RESC1005X40N; ComponentLink1URL: http://www.vishay.com/docs/20035/dcrcwe3.pdf; ComponentLink1Description: Datasheet; Packaging: Cut Tape (CT); Supplier Part Number 1: 541-10.0LCT-ND; Supplier 1: Digi-Key; Features: AEC Q100 automotive; Operating Temperature: -55 °C ~ 155 °C; Package / Case: 0402 (1005 metrico); Manufacturer Part Number: CRCW040210R0FKED; Part Status: Active; Composition: Thick Film; Manufacturer 1: Vishay Dale; Manufacturer Part Number 1: CRCW040210R0FKED
R16 R142 = CRCW04020000Z0EDC: as R2 on sheet [04] - PSU_+5V_AUX; Supplier 1: Digi-Key; Manufacturer Part Number: CRCW04020000Z0EDC; Resistance: 0; Tolerance: ±1%; ComponentLink1URL: http://www.vishay.com/docs/28773/crcwce3.pdf?src-supplier=Digi-Key; ComponentLink1Description: http://www.vishay.com/docs/28773/crcwce3.pdf?src-supplier=Digi-Key; Supplier Part Number 1: 541-4062-1-ND; Manufacturer 1: Vishay; Manufacturer Part Number 1: CRCW04020000Z0EDC; Category: Resistors; Composition: Thick Film; Features: AEC Q100 automotive; Footprint Name: RESC100X50X40L25N; Operating Temperature: -55 °C ~ 155 °C; Package / Case: 0402 (1005 metrico); Packaging: Cut Tape (CT); Part Status: Active; Description 1: RES 0 OHM 1/16W 1% 0402
R19 = CRCW04024K99FKED: RES 4K99 OHM 1/16W 1% 0402; Manufacturer: Vishay Dale; Power (Watts): 0,063 W, 1/16 W; Temperature Coefficient: ±100 ppm/ °C; Category: Resistors; Resistance: 4K99; Tolerance: ±1%; Footprint Name: RESC1005X40N; ComponentLink1URL: http://www.vishay.com/docs/20035/dcrcwe3.pdf; ComponentLink1Description: Datasheet; Packaging: Cut Tape (CT); Supplier Part Number 1: 541-4.99KLCT-ND; Supplier 1: DigiKey; Features: AEC Q100 automotive; Operating Temperature: -55 °C ~ 155 °C; Package / Case: 0402 (1005 metrico); Manufacturer Part Number: CRCW04024K99FKED; Part Status: Active; Composition: Thick Film; Manufacturer 1: Vishay Dale; Manufacturer Part Number 1: CRCW04024K99FKED
R20 = CRCW040221K0FKED: RES 21K OHM 1/16W 1% 0402; Manufacturer: Vishay Dale; Power (Watts): 0,063 W, 1/16 W; Temperature Coefficient: ±100 ppm/ °C; Category: Resistors; Resistance: 21K; Tolerance: ±1%; Footprint Name: RESC1005X40N; ComponentLink1URL: http://www.vishay.com/docs/20035/dcrcwe3.pdf; ComponentLink1Description: Datasheet; Packaging: Cut Tape (CT); Supplier Part Number 1: 541-21.0KLCT-ND; Supplier 1: Digi-Key; Features: AEC Q100 automotive; Operating Temperature: -55 °C ~ 155 °C; Package / Case: 0402 (1005 metrico); Manufacturer Part Number: CRCW040221K0FKED; Part Status: Active; Composition: Thick Film; Manufacturer 1: Vishay Dale; Manufacturer Part Number 1: CRCW040221K0FKED
R21 = WSTM1206QLR043FNR: RES 0R043 OHM 1W 1% 1206; Manufacturer: Littelfuse; ComponentLink1Description: Datasheet; ComponentLink1URL: https://mm.digikey.com/Volume0/opasdata/d220001/medias/docus/4897/WSTM_Series_3-17-23.pdf; Supplier: Digikey; Manufacturer Part Number: WSTM1206QLR043FNR; RoHS: No; Category: Chip SMD Resistors; Stock 1: 4775; Pricing 1: 1=0,61, 10=0,41, 25=0,34, 50=0,2876, 100=0,2153, 250=0,19176, 500=0,1569, 1000=0,12203, 5000=0,10788 (USD); Supplier Part Number: 18-WSTM1206QLR043FNRCT-ND; Resistance: 0R043
R22 = RUT1005FR100CS: RES 0R1 OHM 1/10W 1% 0402; Manufacturer: Samsung Electro-Mechanics America, Inc.; Power (Watts): 0.1W, 1/10W; Temperature Coefficient: ±150ppm/°C; Category: Resistors; Supplier 1: Digi-Key; Supplier Part Number 1: 1276-6167-1-ND; Manufacturer Part Number: RUT1005FR100CS; Packaging: Cut Tape (CT); Part Status: Active; Tolerance: ±1%; Composition: Thick Film; Features: Current Sense, Moisture Resistant; Operating Temperature: -55°C ~ 155°C; Package / Case: 0402 (1005 Metric); ComponentLink1URL: http://www.samsungsem.com/kr/support/library/product-catalog/__icsFiles/afieldfile/2015/09/22/CHIP_RESISTOR_2015.pdf; ComponentLink1Description: http://www.samsungsem.com/kr/support/library/product-catalog/__icsFiles/afieldfile/2015/09/22/CHIP_RESISTOR_2015.pdf; Footprint Name: RESC1005X40N; Resistance: 0R1; Manufacturer 1: Samsung Electro-Mechanics America, Inc.; Manufacturer Part Number 1: RUT1005FR100CS
U17 U20 = SN74LVC2G08QDCURQ1: Automotive 2-ch, 2-input, 1.65-V to 5.5-V AND gates 8-VSSOP -40 to 125; Manufacturer: Texas Instruments; ComponentLink1URL: https://www.ti.com/lit/ds/symlink/sn74lvc2g08-q1.pdf; ComponentLink1Description: Datasheet; Supplier: Digikey; Manufacturer Part Number: SN74LVC2G08QDCURQ1; RoHS: No; Category: Logic Gates; Stock 1: 5504; Pricing 1: 1=0,47, 10=0,33, 25=0,2944, 100=0,2555, 250=0,237, 500=0,22578, 1000=0,21657 (USD); Supplier Part Number: 296-SN74LVC2G08QDCURQ1CT-ND
U19 = LTC4364HDE-2#PBF: Hot Swap Controller 1-CH 80V N-Channel Positive High Voltage Automotive 14-Pin DFN EP Tube; Manufacturer: Analog Devices / Linear Technology; Supplier: Digikey; Manufacturer Part Number: LTC4364HDE-2#PBF; RoHS: Yes; Category: Hot Swap Controllers; Stock 1: 6155; Pricing 1: 1=14,27, 10=10,149, 25=9,0872, 100=7,9018, 250=7,3278, 500=6,9784, 1000=6,8125 (USD); ComponentLink2URL: https://www.analog.com/media/en/technical-documentation/data-sheets/ltc4364-1-4364-2.pdf; ComponentLink2Description: Datasheet; Supplier Part Number: 505-LTC4364HDE-2#PBF-ND

## Nets that join several sheets
GND: [00] - INTERFACES_BOARD (J2.2), [02] - DCDC_+5V7 (22 pins), [04] - PSU_+5V_AUX (6 pins), [03] - OUT_+5V7_OCXO_PROTECTION (12 pins)
+3V3_AUX: [02] - DCDC_+5V7 (Rsync.1), [03] - OUT_+5V7_OCXO_PROTECTION (R6.2 R142.1)
NetC3_2: [01] - PCU_MODULE (R1.1), [02] - DCDC_+5V7 (9 pins), [04] - PSU_+5V_AUX (C3.2 R2.2 U24.1)
NetQ1_5: [01] - PCU_MODULE (R1.2), [03] - OUT_+5V7_OCXO_PROTECTION (6 pins)
OCXO_+5V7: [00] - INTERFACES_BOARD (J2.1), [03] - OUT_+5V7_OCXO_PROTECTION (5 pins)
OUT_DCDC_+12V: [00] - INTERFACES_BOARD (P1.2), [02] - DCDC_+5V7 (6 pins)